# Altium schematic sheet 倒立摆原理图.SchDoc
size A4
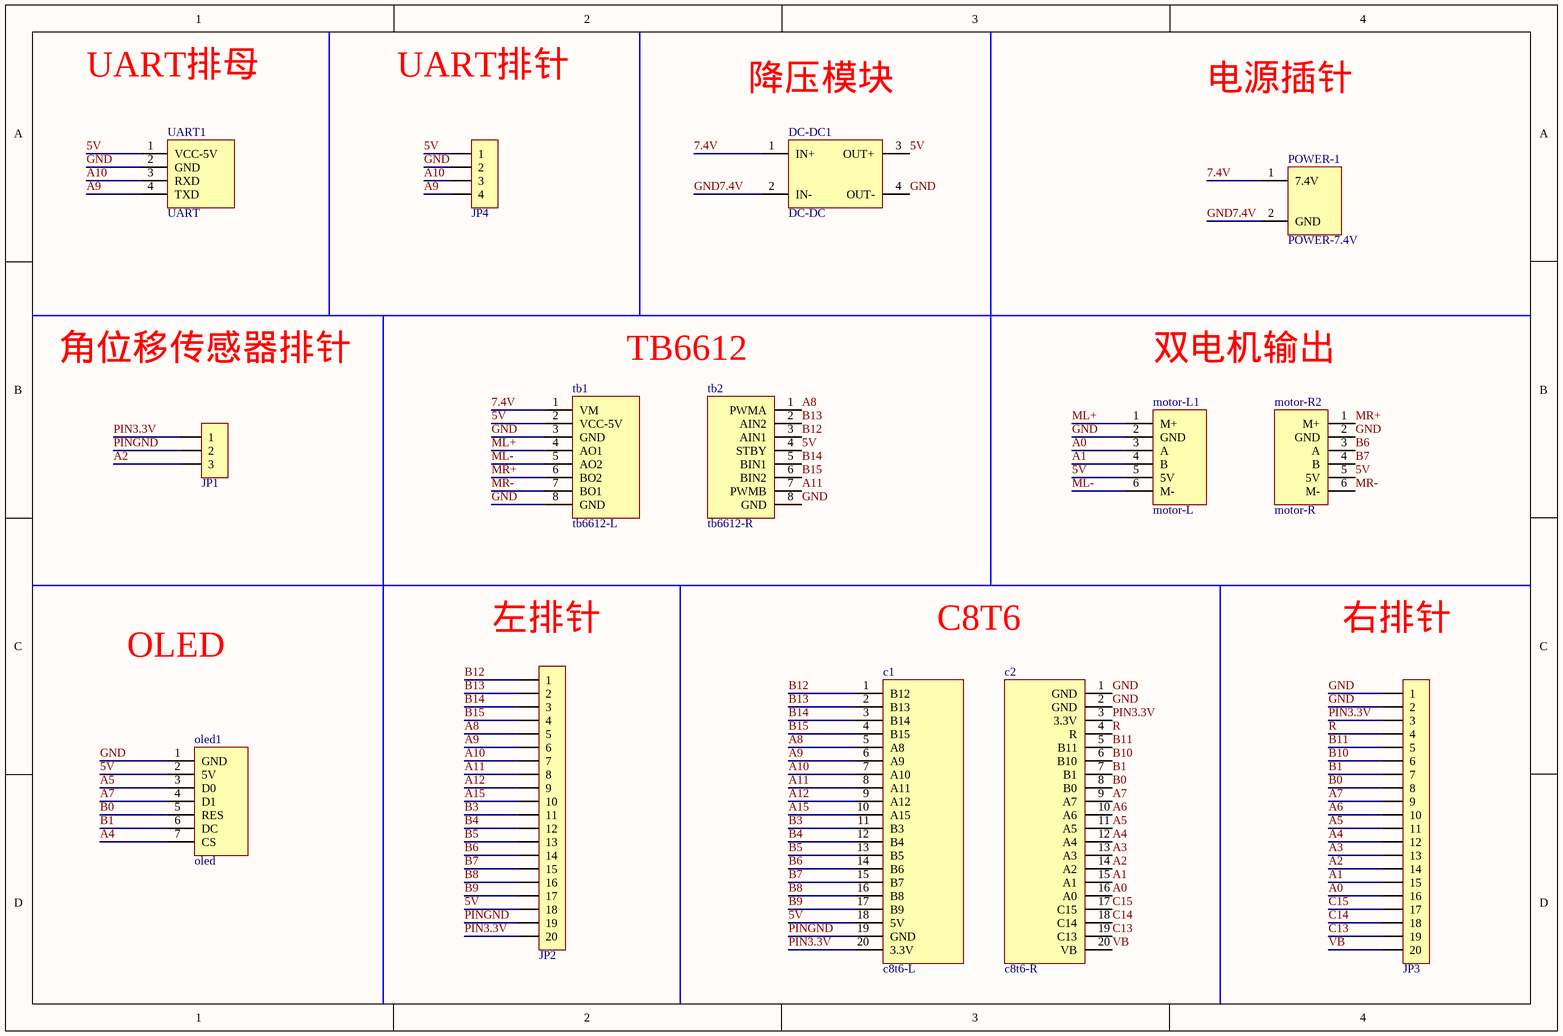
[diagram p0: 倒立摆原理图.SchDoc]

## Parts
c1  c8t6-L  [HDR2.54-M-LI-20P]
c2  c8t6-R  [HDR2.54-M-LI-20P]
DC-DC1  DC-DC  [DC-DC]
JP1  HDR-1X3  [HDR2.54-LI-3P]  (value not drawn)
JP2  HDR-1X20  [HDR2.54-LI-20P]  (value not drawn)
JP3  HDR-1X20  [HDR2.54-LI-20P]  (value not drawn)
JP4  HDR-1X4  [HDR2.54-LI-4P]  (value not drawn)
motor-L1  motor-L  [HDR2.54-WI-6P]
motor-R2  motor-R  [HDR2.54-WI-6P]
oled1  oled  [HDR2.54-M-LI-7P]
POWER-1  POWER-7.4V  [HDR2.54-LI-2P]
tb1  tb6612-L  [HDR2.54-M-LI-8P]
tb2  tb6612-R  [HDR2.54-M-LI-8P]
UART1  UART  [HDR2.54-M-LI-4P]

## Nets
5V: c1.18(5V) DC-DC1.3(OUT+) JP2.18 JP4.1 motor-L1.5(5V) motor-R2.5(5V) oled1.2(5V) tb1.2(VCC-5V) tb2.4(STBY) UART1.1(VCC-5V)
7.4V: DC-DC1.1(IN+) POWER-1.1(7.4V) tb1.1(VM)
A0: c2.16(A0) JP3.16 motor-L1.3(A)
A1: c2.15(A1) JP3.15 motor-L1.4(B)
A2: c2.14(A2) JP1.3 JP3.14
A3: c2.13(A3) JP3.13
A4: c2.12(A4) JP3.12 oled1.7(CS)
A5: c2.11(A5) JP3.11 oled1.3(D0)
A6: c2.10(A6) JP3.10
A7: c2.9(A7) JP3.9 oled1.4(D1)
A8: c1.5(A8) JP2.5 tb2.1(PWMA)
A9: c1.6(A9) JP2.6 JP4.4 UART1.4(TXD)
A10: c1.7(A10) JP2.7 JP4.3 UART1.3(RXD)
A11: c1.8(A11) JP2.8 tb2.7(PWMB)
A12: c1.9(A12) JP2.9
A15: c1.10(A15) JP2.10
B0: c2.8(B0) JP3.8 oled1.5(RES)
B1: c2.7(B1) JP3.7 oled1.6(DC)
B3: c1.11(B3) JP2.11
B4: c1.12(B4) JP2.12
B5: c1.13(B5) JP2.13
B6: c1.14(B6) JP2.14 motor-R2.3(A)
B7: c1.15(B7) JP2.15 motor-R2.4(B)
B8: c1.16(B8) JP2.16
B9: c1.17(B9) JP2.17
B10: c2.6(B10) JP3.6
B11: c2.5(B11) JP3.5
B12: c1.1(B12) JP2.1 tb2.3(AIN1)
B13: c1.2(B13) JP2.2 tb2.2(AIN2)
B14: c1.3(B14) JP2.3 tb2.5(BIN1)
B15: c1.4(B15) JP2.4 tb2.6(BIN2)
C13: c2.19(C13) JP3.19
C14: c2.18(C14) JP3.18
C15: c2.17(C15) JP3.17
GND: c2.1(GND) c2.2(GND) DC-DC1.4(OUT-) JP3.1 JP3.2 JP4.2 motor-L1.2(GND) motor-R2.2(GND) oled1.1(GND) tb1.3(GND) tb1.8(GND) tb2.8(GND) UART1.2(GND)
GND7.4V: DC-DC1.2(IN-) POWER-1.2(GND)
ML+: motor-L1.1(M+) tb1.4(AO1)
ML-: motor-L1.6(M-) tb1.5(AO2)
MR+: motor-R2.1(M+) tb1.6(BO2)
MR-: motor-R2.6(M-) tb1.7(BO1)
PIN3.3V: c1.20(3.3V) c2.3(3.3V) JP1.1 JP2.20 JP3.3
PINGND: c1.19(GND) JP1.2 JP2.19
R: c2.4(R) JP3.4
VB: c2.20(VB) JP3.20

## Notes on the sheet
- UART排母
- UART排针
- 降压模块
- 电源插针
- 角位移传感器排针
- TB6612
- 双电机输出
- (near JP2) 左排针
- C8T6
- 右排针
- OLED

## Library data of the parts
JP1 = Header 3: 3P接插件; 联系卖家，免费查找封装: 唯一出售店铺网址https://shop463601444.taobao.com; 封装库来自淘宝卖家ID:黄晶宝石: 其他店铺购入均为盗版假冒封装库，请立即申请退款，本店现金奖励20~200元; BOM名称: 3P接插件
JP2 JP3 = Header 20: 20P接插件; 联系卖家，免费查找封装: 唯一出售店铺网址https://shop463601444.taobao.com; 封装库来自淘宝卖家ID:黄晶宝石: 其他店铺购入均为盗版假冒封装库，请立即申请退款，本店现金奖励20~200元; BOM名称: 20P接插件
JP4 = Header 4: 4P接插件; 联系卖家，免费查找封装: 唯一出售店铺网址https://shop463601444.taobao.com; 封装库来自淘宝卖家ID:黄晶宝石: 其他店铺购入均为盗版假冒封装库，请立即申请退款，本店现金奖励20~200元; BOM名称: 4P接插件